# EAGLE schematic Timed Piezo Driver (EAGLE 9.7.0)
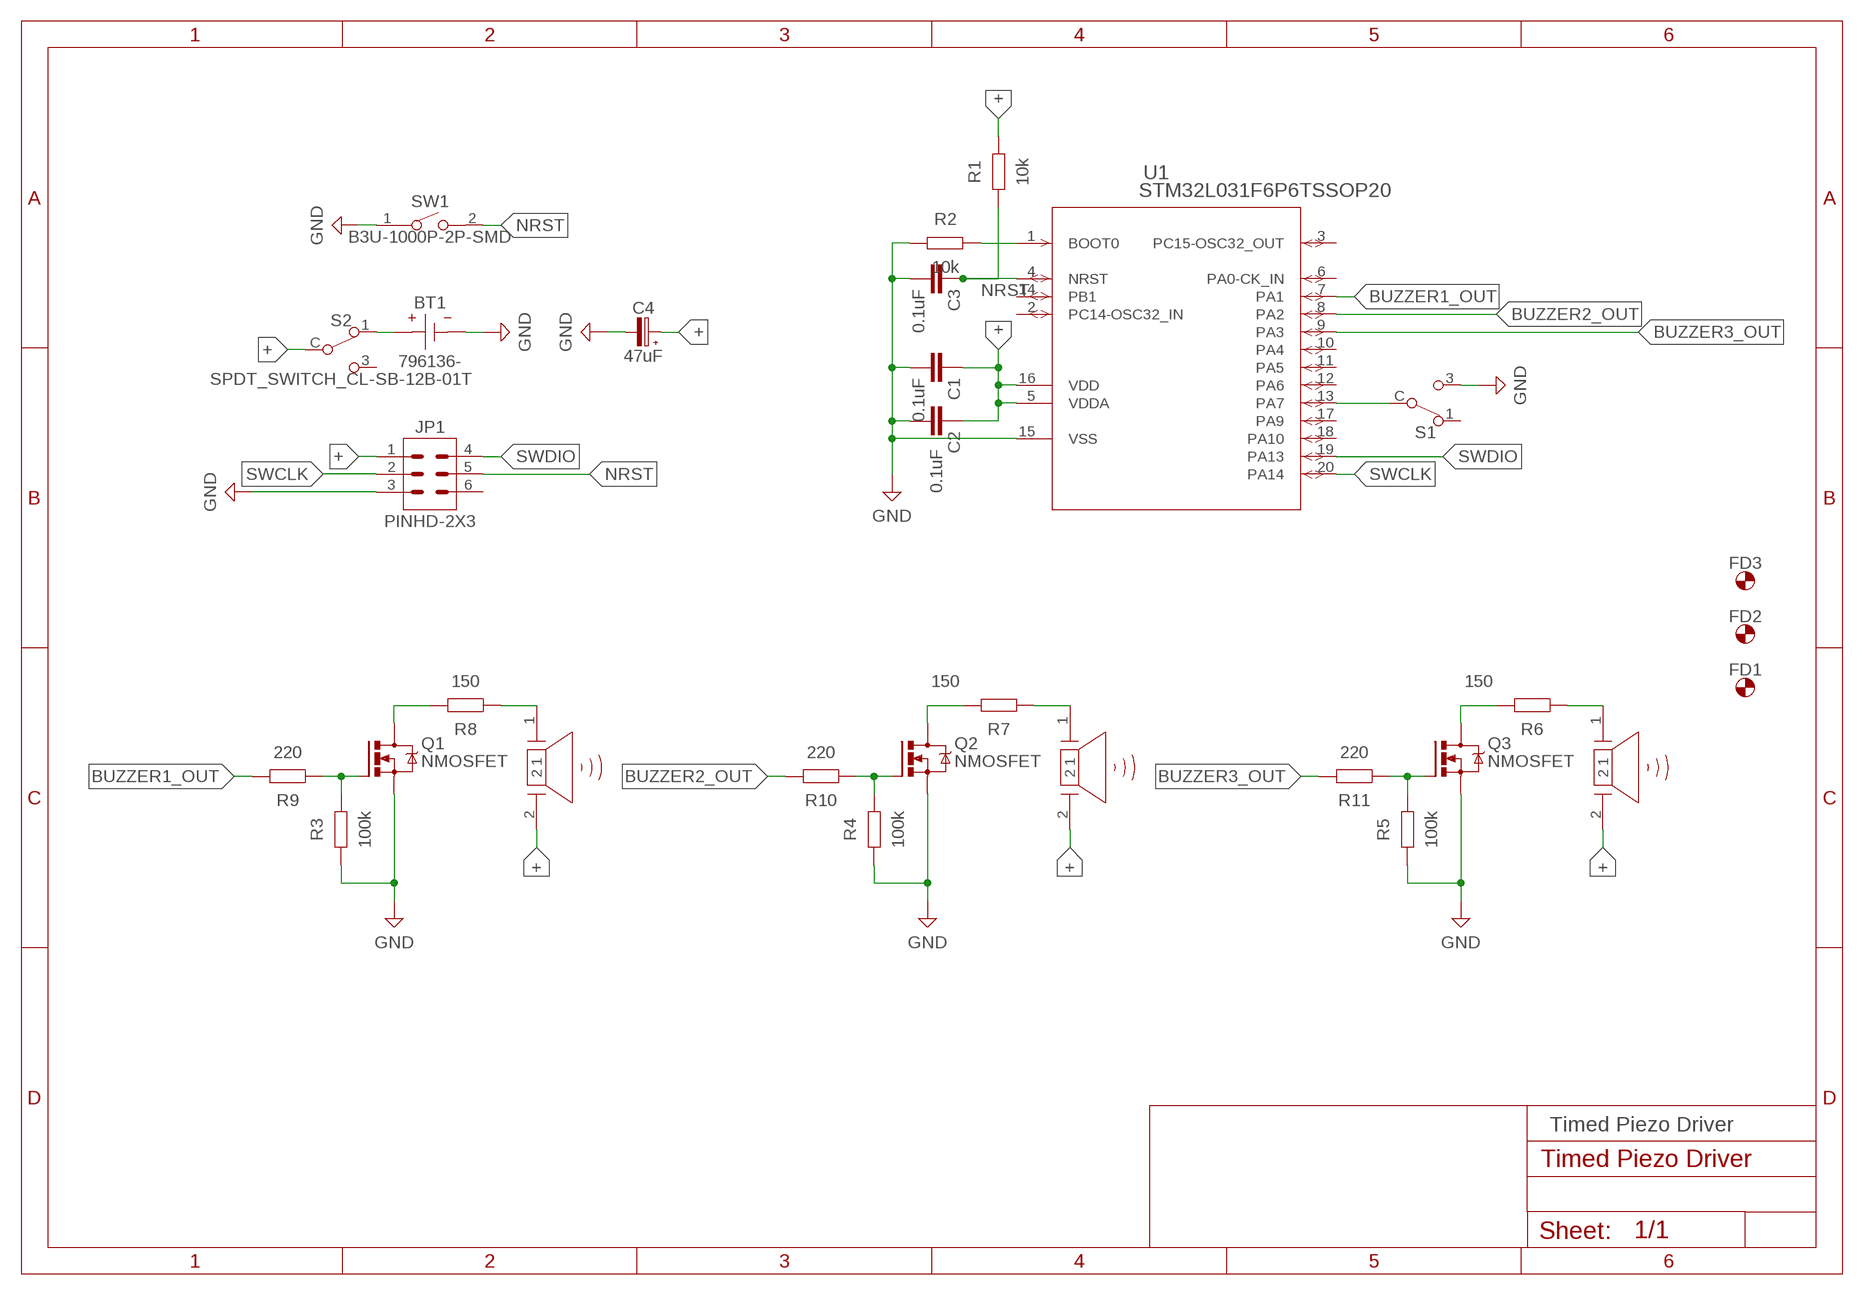
[diagram p0: schematic, sheet 1]

## Parts
BT1  796136-  [796136-1]
C1  0.1uF  0.1UF-0402-16V-10%  [0402]
C2  0.1uF  0.1UF-0402-16V-10%  [0402]
C3  0.1uF  0.1UF-0402-16V-10%  [0402]
C4  47uF  C-POLECAP-4MM  [CAPAE430X430N]
FD1  FID_20MIL  [FID_020]
FD2  FID_20MIL  [FID_020]
FD3  FID_20MIL  [FID_020]
JP1  PINHD-2X3  [2X03]
LS1  PIEZO  [PIEZO]
LS2  PIEZO  [PIEZO]
LS3  PIEZO  [PIEZO]
Q1  NMOSFET  NMOSFET_SOT23  [SOT23]
Q2  NMOSFET  NMOSFET_SOT23  [SOT23]
Q3  NMOSFET  NMOSFET_SOT23  [SOT23]
R1  10k  RCHIP-0402(1005-METRIC)  [RESC1005X40]
R2  10k  RCHIP-0402(1005-METRIC)  [RESC1005X40]
R3  100k  RCHIP-0402(1005-METRIC)  [RESC1005X40]
R4  100k  RCHIP-0402(1005-METRIC)  [RESC1005X40]
R5  100k  RCHIP-0402(1005-METRIC)  [RESC1005X40]
R6  150  RCHIP-0402(1005-METRIC)  [RESC1005X40]
R7  150  RCHIP-0402(1005-METRIC)  [RESC1005X40]
R8  150  RCHIP-0402(1005-METRIC)  [RESC1005X40]
R9  220  RCHIP-0402(1005-METRIC)  [RESC1005X40]
R10  220  RCHIP-0402(1005-METRIC)  [RESC1005X40]
R11  220  RCHIP-0402(1005-METRIC)  [RESC1005X40]
S1  SPDT_SWITCH_CL-SB-12B-01T  [CL-SB-12B-01T]
S2  SPDT_SWITCH_CL-SB-12B-01T  [CL-SB-12B-01T]
SW1  B3U-1000P-2P-SMD  SMD-BUTTON(2P-3.0X2.5X1.2+0.4MM)-B3U-1000P-2P-SMD  [SW2-2.6-3.0X2.5X1.2+0.4MM]
U1  STM32L031F6P6TSSOP20  [TSSOP20]

## Nets
+: BT1.P(+) C1.1 C2.1 C4.1(+) JP1.1 LS1.2 LS2.2 LS3.2 R1.2 S2.1(NC) S2.C(COM) U1.5(VDDA) U1.16(VDD)
BUZZER1_OUT: R9.2 U1.7(PA1)
BUZZER2_OUT: Q2.1(G) R4.2 R10.1 R10.2 U1.8(PA2)
BUZZER3_OUT: Q3.1(G) R5.2 R11.1 R11.2 U1.9(PA3)
GND: BT1.N(-) C1.2 C2.2 C3.2 C4.2(-) JP1.3 Q1.2(S) Q2.2(S) Q3.2(S) R2.2 R3.1 R4.1 R5.1 S1.3(NO) SW1.1 U1.15(VSS)
N$1: R2.1 U1.1(BOOT0)
N$2: Q1.3(D) R8.2
N$3: Q2.3(D) R7.1
N$4: Q3.3(D) R6.2
N$5: S1.C(COM) U1.13(PA7)
N$6: LS3.1 R6.1
N$7: LS2.1 R7.2
N$8: LS1.1 R8.1
N$9: Q1.1(G) R3.2 R9.1
NRST: C3.1 JP1.5 R1.1 SW1.2 U1.4(NRST)
SWCLK: JP1.2 U1.20(PA14)
SWDIO: JP1.4 U1.19(PA13)
Unconnected: JP1.6 S1.1(NC) S2.3(NO) U1.2(PC14-OSC32_IN) U1.3(PC15-OSC32_OUT) U1.6(PA0-CK_IN) U1.10(PA4) U1.11(PA5) U1.12(PA6) U1.14(PB1) U1.17(PA9) U1.18(PA10)

## Notes on the sheet
- Timed Piezo Driver

## Library data of the parts
BT1 = Battery_Holder:796136-*: TE Coin Cell Battery Holder 20mm SMD CR2032
C1-C3 = SparkFun-RF:0.1UF: 0.1µF ceramic capacitors A capacitor is a passive two-terminal electrical component used to store electrical energy temporarily in an electric field.
C4 = Capacitor:C-POL: Capacitor Polarised - Generic
FD1-FD3 = PCB_Utilities:FID: Fiducial marks. Top and Bottom copper with stop mask
JP1 = Connector:PINHD-2X3: Pin Header
LS1-LS3 = Tinkercad:PIEZO: Piezoelectric Sounders / Buzzers Reference Datasheet <https://www.murata.com/products/productdata/8801054621726/SPEC-PKM17EPPH4001-B0.pdf?1517839212000>
Q1-Q3 = Tinkercad:NMOSFET: N-Channel MOSFET - Generic
R1-R11 = Resistor:R: Resistor Fixed - Generic
S1 S2 = Switch:SPDT_SWITCH: SPDT Switches
SW1 = Fidget_Spinner:SMD-BUTTON(2P-3.0X2.5X1.2+0.4MM): 311020047
U1 = 2026-06-21_14-31-46_Library:STM32L031F6P6